# Altium schematic sheet Microcomputer.SchDoc
size A4
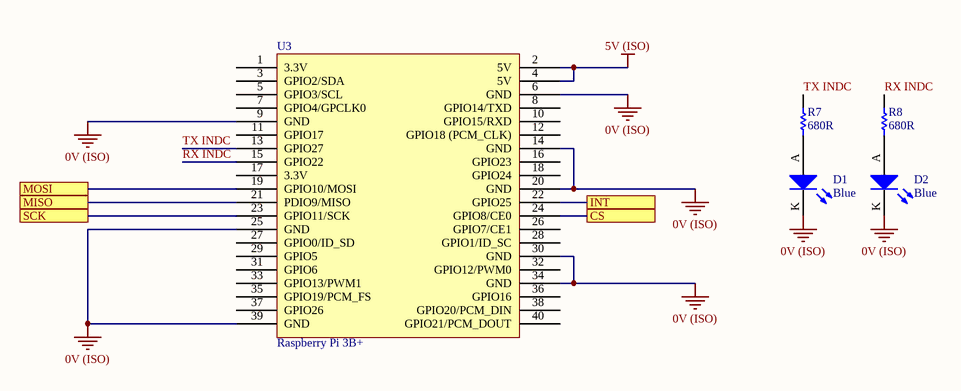
[diagram p0: Microcomputer.SchDoc]

## Parts
D1  Blue  [0805 LED]
D2  Blue  [0805 LED]
R7  680R  [0805]
R8  680R  [0805]
U3  Raspberry Pi 3B+  [Raspberry Pi 3B+]

## Ports
CS, INT, MISO, MOSI, SCK

## Nets
0V (ISO): D1.K D2.K U3.6(GND) U3.9(GND) U3.14(GND) U3.20(GND) U3.25(GND) U3.30(GND) U3.34(GND) U3.39(GND)
5V (ISO): U3.2(5V) U3.4(5V)
CS: U3.24(GPIO8/CE0) ; port CS
INT: U3.22(GPIO25) ; port INT
MISO: U3.21(PDIO9/MISO) ; port MISO
MOSI: U3.19(GPIO10/MOSI) ; port MOSI
RX INDC: R8.2 U3.15(GPIO22)
SCK: U3.23(GPIO11/SCK) ; port SCK
TX INDC: R7.2 U3.13(GPIO27)
NetD1_A: D1.A R7.1
NetD2_A: D2.A R8.1

Not connected (* = marked no-connect by the designer): U3 1(3.3V) 3(GPIO2/SDA) 5(GPIO3/SCL) 7(GPIO4/GPCLK0) 8(GPIO14/TXD) 10(GPIO15/RXD) 11(GPIO17) 12(GPIO18_(PCM_CLK)) 16(GPIO23) 17(3.3V) 18(GPIO24) 26(GPIO7/CE1) 27(GPIO0/ID_SD) 28(GPIO1/ID_SC) 29(GPIO5) 31(GPIO6) 32(GPIO12/PWM0) 33(GPIO13/PWM1) 35(GPIO19/PCM_FS) 36(GPIO16) 37(GPIO26) 38(GPIO20/PCM_DIN) 40(GPIO21/PCM_DOUT)

## Library data of the parts
D1 D2 = SML-MN2BCTT86C: LED BLUE CLEAR 2012 SMD; Manufacturer: ROHM Semiconductor; Part Number: SML-MN2BCTT86C; Colour: Blue; Digikey Part Number: 846-1207-1-ND; Digikey Link: https://www.digikey.com/product-detail/en/rohm-semiconductor/SMLMN2BCTT86C/846-1207-1-ND/6057239
R7 R8 = RC0805FR07680RL: Manufacturer: YAGEO; Tolerance: 0.01; Rated Voltage: 0.125W; Part Number: RC0805FR07680RL; Value: 680R; Material: FR-07; Digikey Part Number: 311-680CRCT-ND
U3 = Raspberry Pi 3B+: 1.4GHz 64-bit quad-core processor, dual-band wireless LAN, Bluetooth 4.2/BLE, faster Ethernet, and Power-over-Ethernet support (with separate PoE HAT); Part Number: Raspberry Pi 3B+; Link: https://www.raspberrypi.org/products/raspberry-pi-3-model-b-plus/